# EAGLE design pcb lipo (EAGLE 9.3.0)
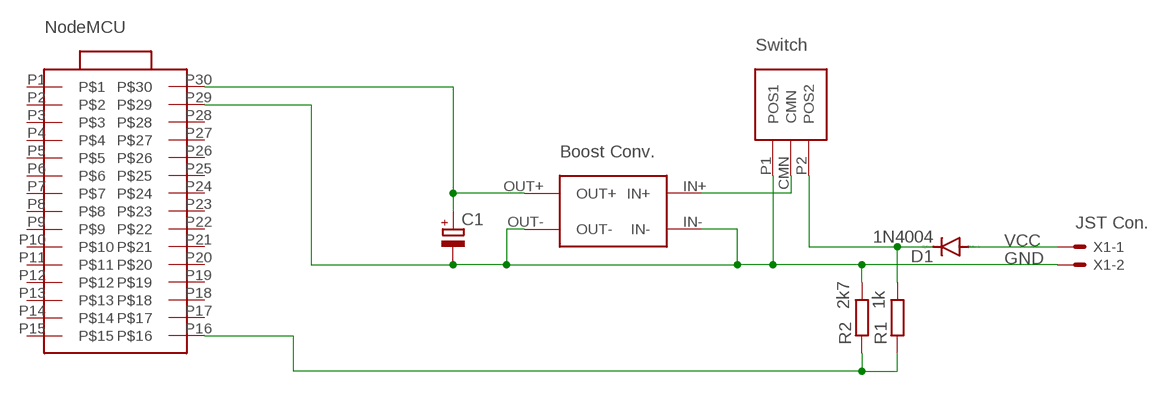
[diagram p0: schematic, sheet 1]

## Parts
C1  CPOL-EUE1.8-4  [E1,8-4]
D1  1N4004  [DO41-10]
R1  1k  R-EU_0207/7  [0207/7]
R2  2k7  R-EU_0207/7  [0207/7]
U$1  NODEMCU  [DIP]
U$2  MODULE  [MODULE]
U$3  SWITCH  [DIP]
X1  22-23-2021  [22-23-2021]

## Nets
GND: C1.- R2.2 U$1.P29 U$2.IN- U$2.OUT- U$3.P1(POS1) X1.2
N$1: C1.+ U$1.P30 U$2.OUT+
N$2: U$2.IN+ U$3.CMN
N$3: D1.C R1.2 U$3.P2(POS2)
N$5: R1.1 R2.1 U$1.P16
VCC: D1.A X1.1
Unconnected: U$1.P1 U$1.P2 U$1.P3 U$1.P4 U$1.P5 U$1.P6 U$1.P7 U$1.P8 U$1.P9 U$1.P10 U$1.P11 U$1.P12 U$1.P13 U$1.P14 U$1.P15 U$1.P17 U$1.P18 U$1.P19 U$1.P20 U$1.P21 U$1.P22 U$1.P23 U$1.P24 U$1.P25 U$1.P26 U$1.P27 U$1.P28

## Notes on the sheet
- NodeMCU
- Switch
- Boost Conv.
- JST Con.

## Library data of the parts
C1 = rcl:CPOL-EU: POLARIZED CAPACITOR, European symbol; SPICEPREFIX: C
D1 = diode:1N4004: DIODE general purpose rectifier, 1 A
R1 R2 = rcl:R-EU_: RESISTOR, European symbol; SPICEPREFIX: R
U$1 = NodeMCU:NODEMCU
U$2 = bst_converter:MODULE
U$3 = switch:SWITCH
X1 = con-molex:22-23-2021: .100" (2.54mm) Center Header - 2 Pin; MF: MOLEX; MPN: 22-23-2021; OC_FARNELL: 1462926; OC_NEWARK: 25C3832

## Board
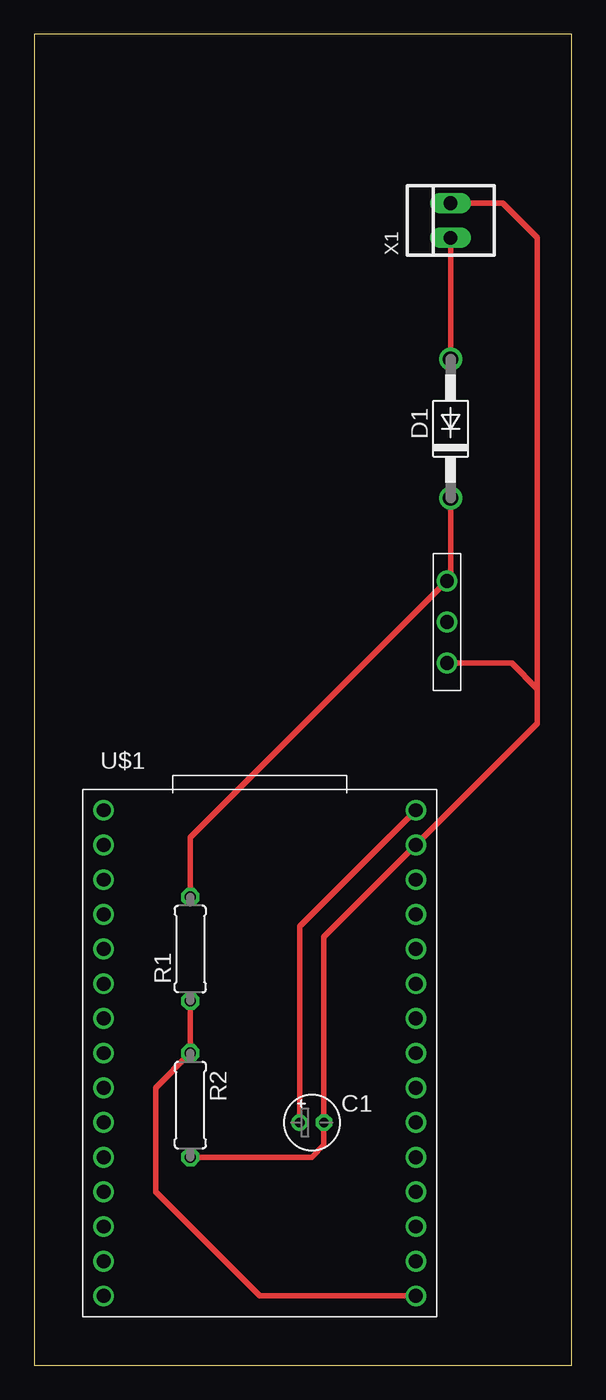
[diagram p1: board, top side]
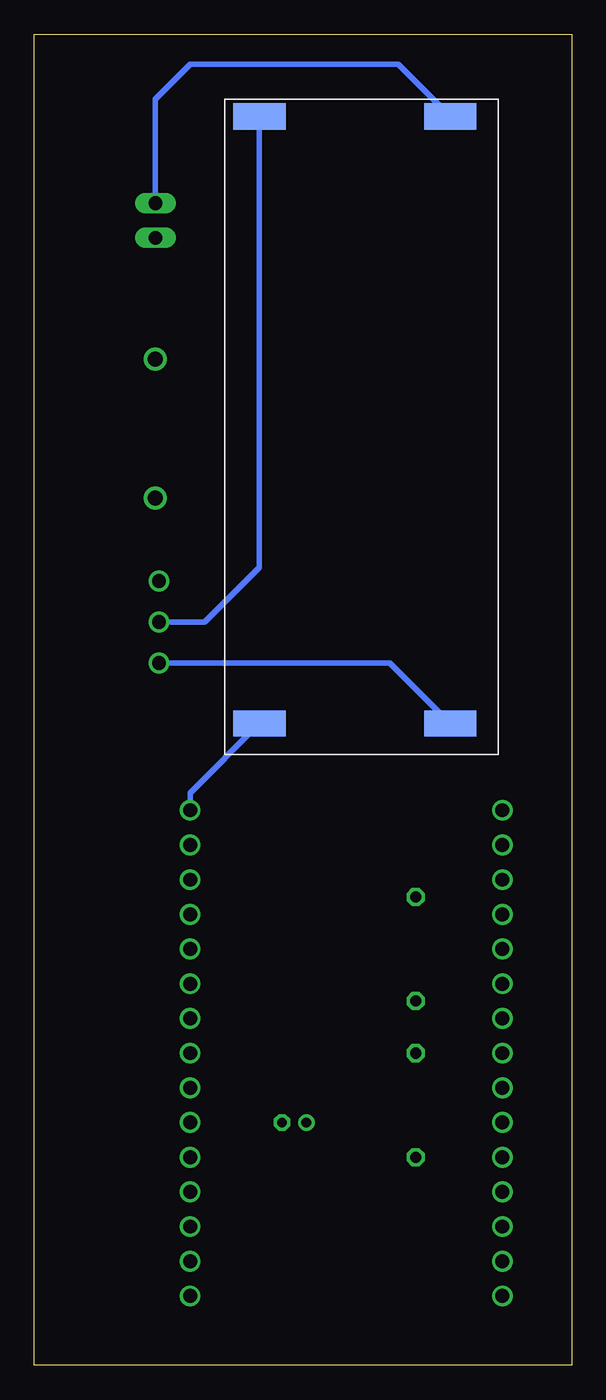
[diagram p2: board, bottom side, seen from below]

Size 39.35 x 97.46 mm. Coordinates in mm from the lower left corner, seen from the top.
Outline: 0,0 39.35,0 39.35,97.46 0,97.46 0,0
Copper layers (1*16): Top 0.035mm / dielectric 1.5mm / Bottom 0.035mm
Design rules "default": minimum track width 6mil, minimum drill 0.35mm, track to track 6mil, track to pad 6mil, pad to pad 6mil, via to via 6mil, smd to smd 6mil, copper to edge 40mil, drill to drill 6mil, minimum pad ring 10mil, minimum via ring 8mil, stop-mask expansion 4mil, vias tented up to drill 0mil, thermal gap 10mil

### Footprints (pad centres in the part's own frame; a part is rotated, then mirrored left to right if it is on the bottom)
E1,8-4 = drill 0.711 pad 1.168: + -0.889,0 | drill 0.711 pad 1.168 octagon: - 0.889,0
DO41-10 = drill 1.118: A 5.08,0; C -5.08,0
0207/7 = drill 0.813 octagon: 1 -3.81,0; 2 3.81,0
DIP = drill 1.016: P1 1.27,36.83; P2 1.27,34.29; P3 1.27,31.75; P4 1.27,29.21; P5 1.27,26.67; P6 1.27,24.13; P7 1.27,21.59; P8 1.27,19.05; P9 1.27,16.51; P10 1.27,13.97; P11 1.27,11.43; P12 1.27,8.89; P13 1.27,6.35; P14 1.27,3.81; P15 1.27,1.27; P16 24.13,1.27; P17 24.13,3.81; P18 24.13,6.35; P19 24.13,8.89; P20 24.13,11.43; P21 24.13,13.97; P22 24.13,16.51; P23 24.13,19.05; P24 24.13,21.59; P25 24.13,24.13; P26 24.13,26.67; P27 24.13,29.21; P28 24.13,31.75; P29 24.13,34.29; P30 24.13,36.83
MODULE = smd 1.93 x 3.81: IN+ 1.27,2.54; IN- 1.27,16.51; OUT+ 45.72,2.54; OUT- 45.72,16.51
DIP' = drill 1: CMN 4,1; P1 7,1; P2 1,1
22-23-2021 = drill 1 long: 1 -1.27,0; 2 1.27,0

### Placement (x,y rotation side)
C1  20.32,17.78 0 top
D1  30.48,68.58 90 top
R1  11.43,30.48 90 top
R2  11.43,19.05 270 top
U$1  3.81,3.81 0 top
U$2  25.4,92.71 270 bottom
U$3  SWITCH  [DIP']  29.21,58.42 270 top
X1  30.48,83.82 90 top

### Tracks (layer width: path | path; a pad name or v marks a point on that pad's centre or on a via)
GND
  Top 0.406: 36.83,49.53 36.83,46.99 U$1.P29 21.21,31.37 C1.- 21.21,16.13 20.32,15.24 R2.2 | 36.83,49.53 34.94,51.42 U$3.P1 | X1.2 34.29,85.09 36.83,82.55 36.83,49.53
  Bottom 0.406: U$2.OUT- 13.32,51.42 U$3.P1 | U$2.IN- 12.7,95.25 27.94,95.25 30.48,92.71 X1.2
N$1
  Top 0.406: U$1.P30 19.43,32.13 C1.+
  Bottom 0.406: U$2.OUT+ 27.94,41.91 U$1.P30
N$2
  Bottom 0.406: U$2.IN+ 22.86,58.42 26.86,54.42 U$3.CMN
N$3
  Top 0.406: D1.C 30.48,57.69 U$3.P2 11.43,38.64 R1.2
N$5
  Top 0.406: R1.1 R2.1 8.89,20.32 8.89,12.7 16.51,5.08 U$1.P16
VCC
  Top 0.406: X1.1 D1.A